# EAGLE schematic NN22_7Lvl_ResSrcAdapter02_s00 (EAGLE 7.7.0)

## Sheet 1 of 2
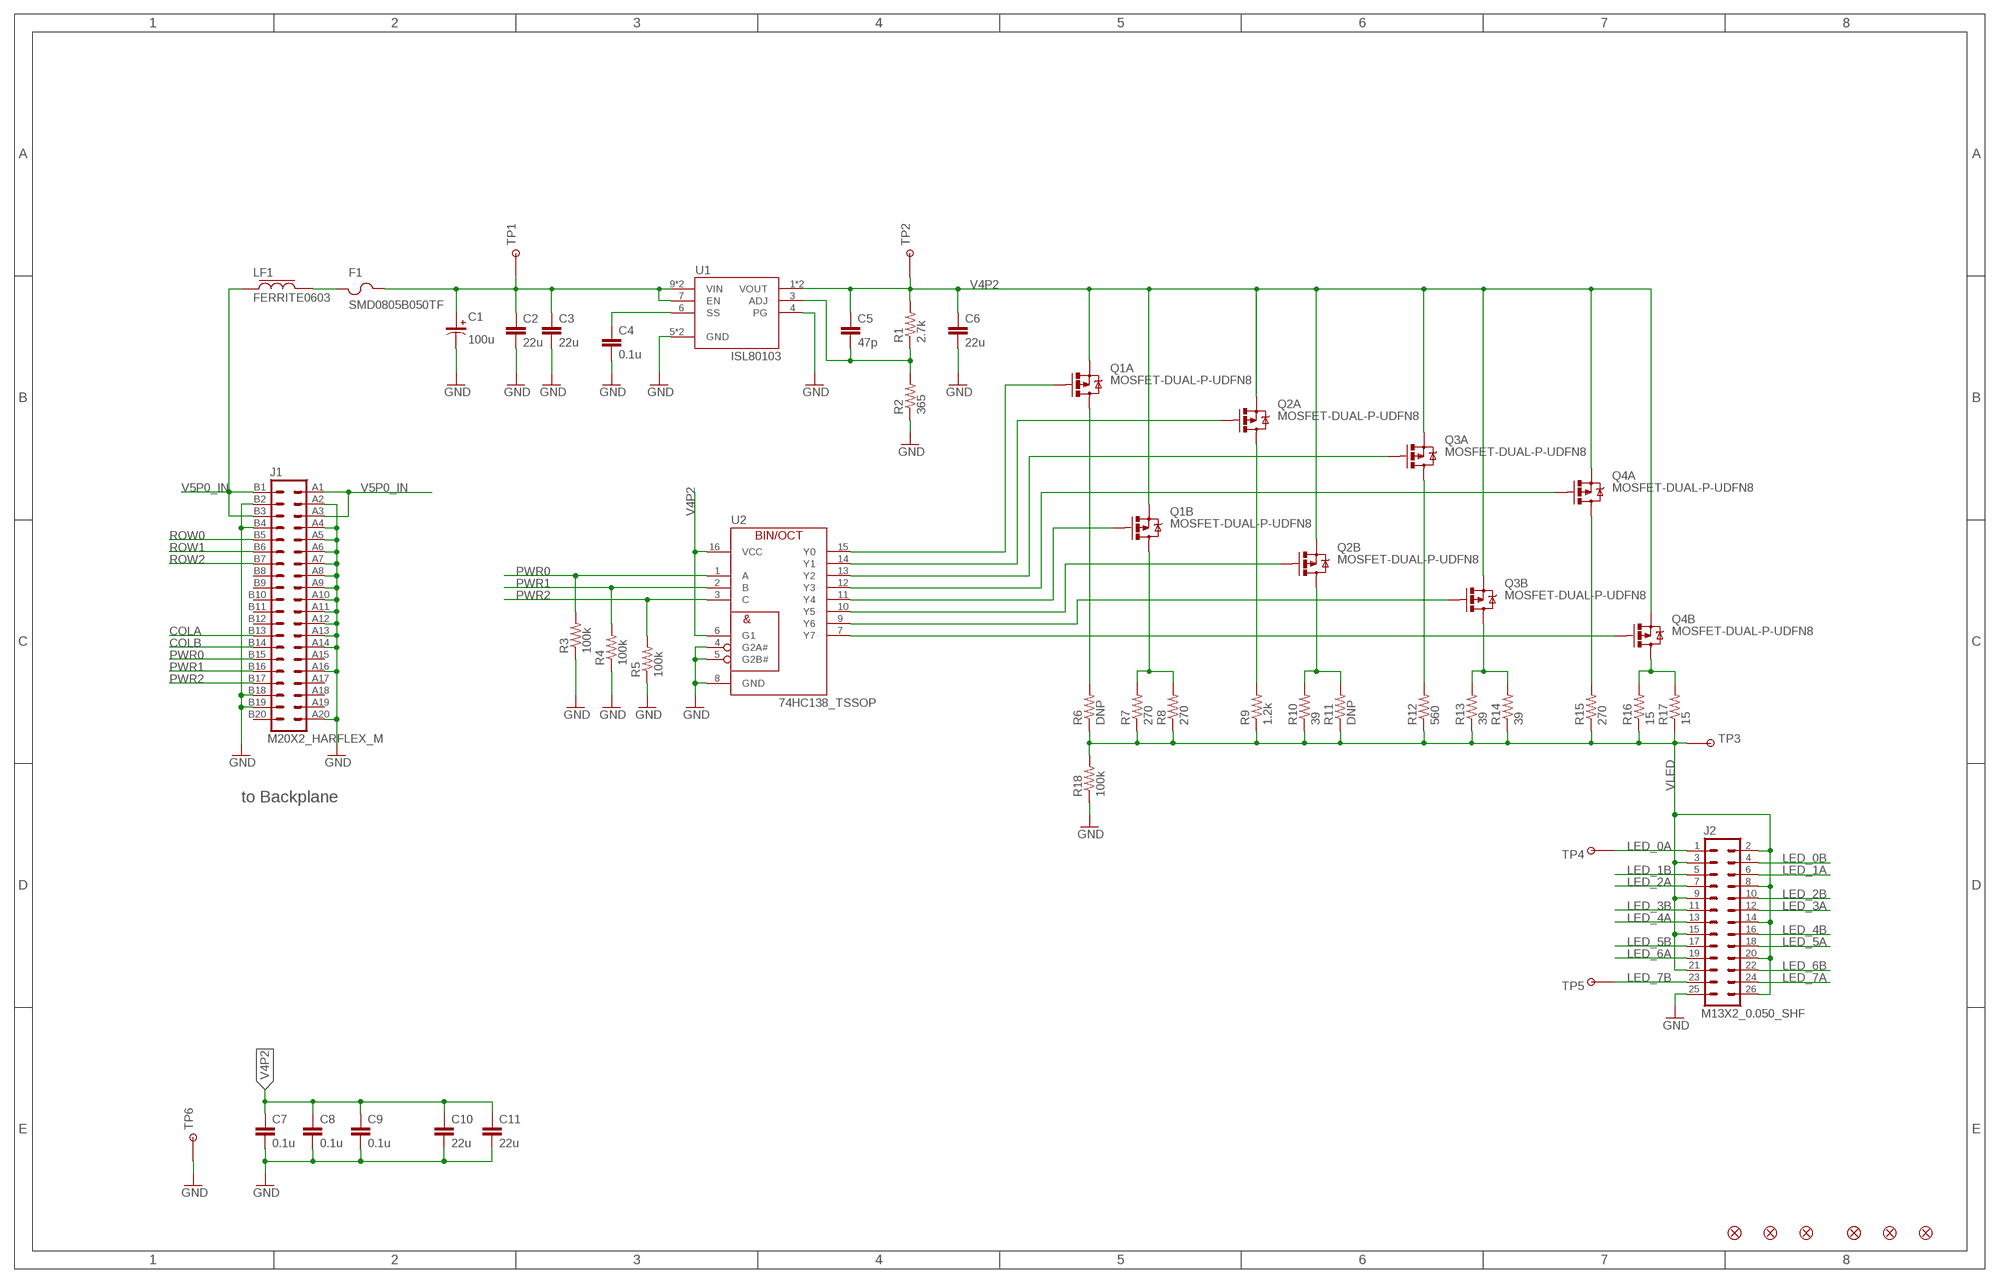
[diagram p0: schematic, sheet 1]

### Parts
C1  100u  CAP-POL2917  [2917-CAP]
C2  22u  CAP1206  [1206]
C3  22u  CAP1206  [1206]
C4  0.1u  CAP0402-CAP  [0402-CAP]
C5  47p  CAP0402-CAP  [0402-CAP]
C6  22u  CAP1206  [1206]
C7  0.1u  CAP0402-CAP  [0402-CAP]
C8  0.1u  CAP0402-CAP  [0402-CAP]
C9  0.1u  CAP0402-CAP  [0402-CAP]
C10  22u  CAP1206  [1206]
C11  22u  CAP1206  [1206]
F1  SMD0805B050TF  FUSE_0805  [0805]
FID1  FIDUCIALUFIDUCIAL  [MICRO-FIDUCIAL]
FID2  FIDUCIALUFIDUCIAL  [MICRO-FIDUCIAL]
FID3  FIDUCIALUFIDUCIAL  [MICRO-FIDUCIAL]
FID4  FIDUCIALUFIDUCIAL  [MICRO-FIDUCIAL]
FID5  FIDUCIALUFIDUCIAL  [MICRO-FIDUCIAL]
FID6  FIDUCIALUFIDUCIAL  [MICRO-FIDUCIAL]
J1  M20X2_HARFLEX_M  [M20X2_HARFLEX_M]
J2  M13X2_0.050_SHF  [M13X2_0.050_SHF]
LF1  FERRITE0603  [0603-FER]
Q1  MOSFET-DUAL-P-UDFN8  [UDFN8]
Q2  MOSFET-DUAL-P-UDFN8  [UDFN8]
Q3  MOSFET-DUAL-P-UDFN8  [UDFN8]
Q4  MOSFET-DUAL-P-UDFN8  [UDFN8]
R1  2.7k  RESISTOR0402-RES  [0402-RES]
R2  365  RESISTOR0402-RES  [0402-RES]
R3  100k  RESISTOR0402-RES  [0402-RES]
R4  100k  RESISTOR0402-RES  [0402-RES]
R5  100k  RESISTOR0402-RES  [0402-RES]
R6  DNP  RESISTOR0805-RES  [0805]
R7  270  RESISTOR0805-RES  [0805]
R8  270  RESISTOR0805-RES  [0805]
R9  1.2k  RESISTOR0805-RES  [0805]
R10  39  RESISTOR0805-RES  [0805]
R11  DNP  RESISTOR0805-RES  [0805]
R12  560  RESISTOR0805-RES  [0805]
R13  39  RESISTOR0805-RES  [0805]
R14  39  RESISTOR0805-RES  [0805]
R15  270  RESISTOR0805-RES  [0805]
R16  15  RESISTOR0805-RES  [0805]
R17  15  RESISTOR0805-RES  [0805]
R18  100k  RESISTOR0402-RES  [0402-RES]
TP1  TESTPOINT_ROUND  [TESTPAD_ROUND]
TP2  TESTPOINT_ROUND  [TESTPAD_ROUND]
TP3  TESTPOINT_ROUND  [TESTPAD_ROUND]
TP4  TESTPOINT_ROUND  [TESTPAD_ROUND]
TP5  TESTPOINT_ROUND  [TESTPAD_ROUND]
TP6  TESTPOINT1X01  [1X01]
U1  ISL80103  [DFN10_ISL]
U2  74HC138_TSSOP  [TSSOP16]

### Nets
COLA: J1.B13 ; also sheet 2
COLB: J1.B14 ; also sheet 2
GND: C1.N C2.2 C3.2 C4.2 C6.2 C7.2 C8.2 C9.2 C10.2 C11.2 J1.A2 J1.A4 J1.A5 J1.A6 J1.A7 J1.A8 J1.A9 J1.A10 J1.A11 J1.A12 J1.A13 J1.A14 J1.A16 J1.A20 J1.B2 J1.B4 J1.B18 J1.B19 J2.25 R2.1 R3.1 R4.1 R5.1 R18.1 TP6.1 U1.4(PG) U1.5(GND) U1.PAD(GND) U2.4(G2A#) U2.5(G2B#) U2.8(GND) ; also sheet 2
LED_0A: J2.1 TP4.P$1 ; also sheet 2
LED_0B: J2.4 ; also sheet 2
LED_1A: J2.6 ; also sheet 2
LED_1B: J2.5 ; also sheet 2
LED_2A: J2.7 ; also sheet 2
LED_2B: J2.10 ; also sheet 2
LED_3A: J2.12 ; also sheet 2
LED_3B: J2.11 ; also sheet 2
LED_4A: J2.13 ; also sheet 2
LED_4B: J2.16 ; also sheet 2
LED_5A: J2.18 ; also sheet 2
LED_5B: J2.17 ; also sheet 2
LED_6A: J2.19 ; also sheet 2
LED_6B: J2.22 ; also sheet 2
LED_7A: J2.24 ; also sheet 2
LED_7B: J2.23 TP5.P$1 ; also sheet 2
N$3: C4.1 U1.6(SS)
N$6: Q1.2(A:G) U2.15(Y0)
N$7: Q2.2(A:G) U2.14(Y1)
N$11: Q3.2(A:G) U2.13(Y2)
N$12: Q4.2(A:G) U2.12(Y3)
N$17: Q1.5(B:G) U2.11(Y4)
N$18: Q2.5(B:G) U2.10(Y5)
N$21: Q3.5(B:G) U2.9(Y6)
N$22: Q4.5(B:G) U2.7(Y7)
N$23: Q1.6(A:D) Q1.P1(A:D) R6.2
N$24: Q1.3(B:D) Q1.P2(B:D) R7.2 R8.2
N$25: Q2.3(B:D) Q2.P2(B:D) R10.2 R11.2
N$27: Q2.6(A:D) Q2.P1(A:D) R9.2
N$28: Q3.6(A:D) Q3.P1(A:D) R12.2
N$31: Q3.3(B:D) Q3.P2(B:D) R13.2 R14.2
N$32: Q4.6(A:D) Q4.P1(A:D) R15.2
N$35: Q4.3(B:D) Q4.P2(B:D) R16.2 R17.2
N$65: F1.1 LF1.2
N$66: C1.P C2.1 C3.1 F1.2 TP1.P$1 U1.7(EN) U1.9(VIN) U1.10(VIN)
N$68: C5.2 R1.1 R2.2 U1.3(ADJ)
PWR0: J1.B15 R3.2 U2.1(A)
PWR1: J1.B16 R4.2 U2.2(B)
PWR2: J1.B17 R5.2 U2.3(C)
ROW0: J1.B5 ; also sheet 2
ROW1: J1.B6 ; also sheet 2
ROW2: J1.B7 ; also sheet 2
V4P2: C5.1 C6.1 C7.1 C8.1 C9.1 C10.1 C11.1 Q1.1(A:S) Q1.4(B:S) Q2.1(A:S) Q2.4(B:S) Q3.1(A:S) Q3.4(B:S) Q4.1(A:S) Q4.4(B:S) R1.2 TP2.P$1 U1.1(VOUT) U1.2(VOUT) U2.6(G1) U2.16(VCC) ; also sheet 2
V5P0_IN: J1.A1 J1.A3 J1.B1 J1.B3 LF1.1
VLED: J2.2 J2.3 J2.8 J2.9 J2.14 J2.15 J2.20 J2.21 J2.26 R6.1 R7.1 R8.1 R9.1 R10.1 R11.1 R12.1 R13.1 R14.1 R15.1 R16.1 R17.1 R18.2 TP3.P$1 ; also sheet 2
Unconnected: J1.A15 J1.A17 J1.A18 J1.A19 J1.B8 J1.B9 J1.B10 J1.B11 J1.B12 J1.B20

### Notes on the sheet
- to Backplane

## Sheet 2 of 2
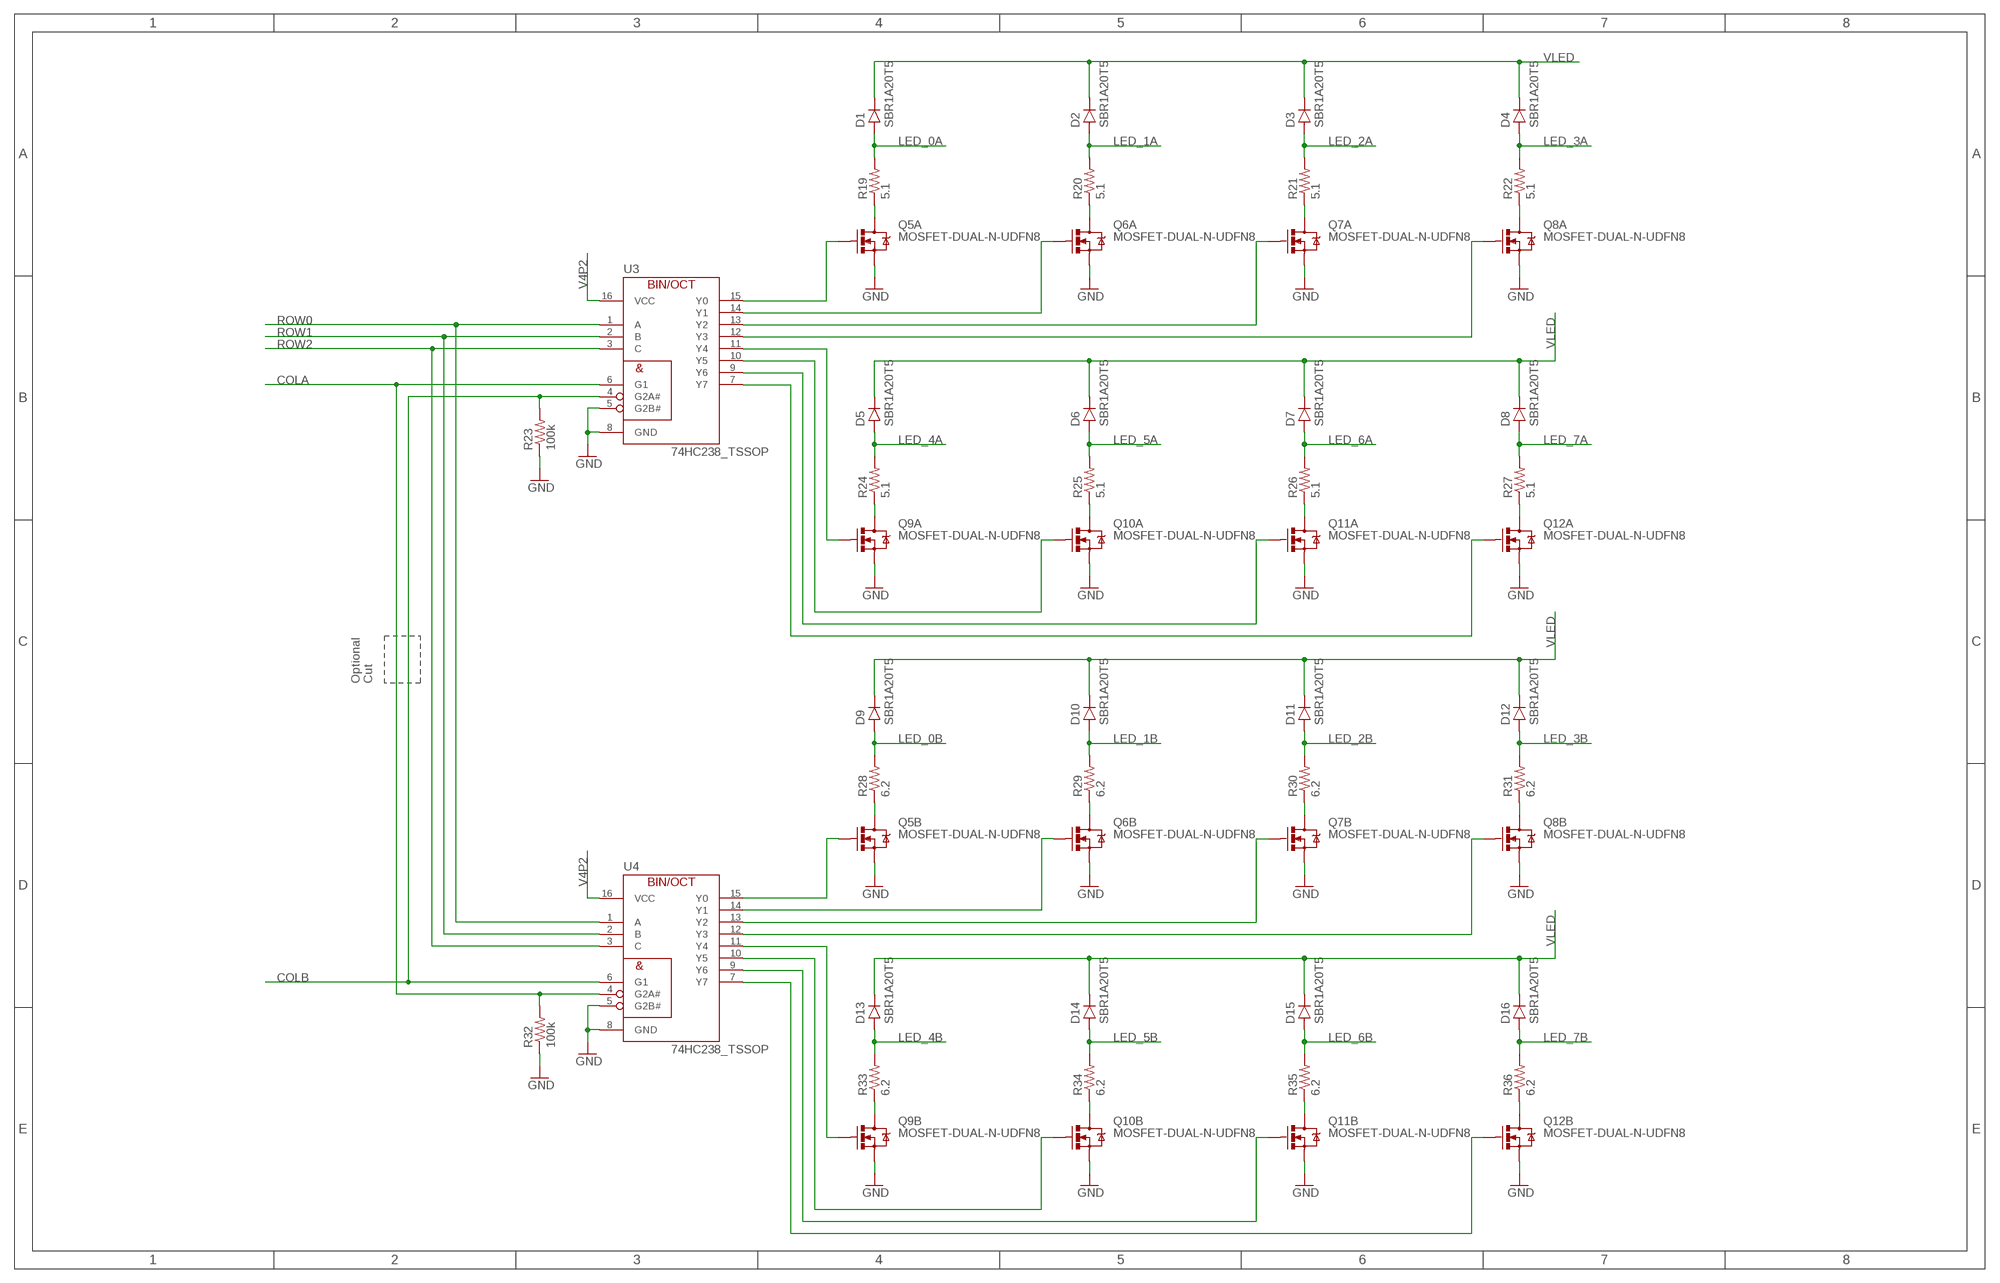
[diagram p1: schematic, sheet 2]

### Parts
D1  SBR1A20T5  DIODE_SOD523  [SOD523]
D2  SBR1A20T5  DIODE_SOD523  [SOD523]
D3  SBR1A20T5  DIODE_SOD523  [SOD523]
D4  SBR1A20T5  DIODE_SOD523  [SOD523]
D5  SBR1A20T5  DIODE_SOD523  [SOD523]
D6  SBR1A20T5  DIODE_SOD523  [SOD523]
D7  SBR1A20T5  DIODE_SOD523  [SOD523]
D8  SBR1A20T5  DIODE_SOD523  [SOD523]
D9  SBR1A20T5  DIODE_SOD523  [SOD523]
D10  SBR1A20T5  DIODE_SOD523  [SOD523]
D11  SBR1A20T5  DIODE_SOD523  [SOD523]
D12  SBR1A20T5  DIODE_SOD523  [SOD523]
D13  SBR1A20T5  DIODE_SOD523  [SOD523]
D14  SBR1A20T5  DIODE_SOD523  [SOD523]
D15  SBR1A20T5  DIODE_SOD523  [SOD523]
D16  SBR1A20T5  DIODE_SOD523  [SOD523]
Q5  MOSFET-DUAL-N-UDFN8  [UDFN8]
Q6  MOSFET-DUAL-N-UDFN8  [UDFN8]
Q7  MOSFET-DUAL-N-UDFN8  [UDFN8]
Q8  MOSFET-DUAL-N-UDFN8  [UDFN8]
Q9  MOSFET-DUAL-N-UDFN8  [UDFN8]
Q10  MOSFET-DUAL-N-UDFN8  [UDFN8]
Q11  MOSFET-DUAL-N-UDFN8  [UDFN8]
Q12  MOSFET-DUAL-N-UDFN8  [UDFN8]
R19  5.1  RESISTOR0805-RES  [0805]
R20  5.1  RESISTOR0805-RES  [0805]
R21  5.1  RESISTOR0805-RES  [0805]
R22  5.1  RESISTOR0805-RES  [0805]
R23  100k  RESISTOR0402-RES  [0402-RES]
R24  5.1  RESISTOR0805-RES  [0805]
R25  5.1  RESISTOR0805-RES  [0805]
R26  5.1  RESISTOR0805-RES  [0805]
R27  5.1  RESISTOR0805-RES  [0805]
R28  6.2  RESISTOR0805-RES  [0805]
R29  6.2  RESISTOR0805-RES  [0805]
R30  6.2  RESISTOR0805-RES  [0805]
R31  6.2  RESISTOR0805-RES  [0805]
R32  100k  RESISTOR0402-RES  [0402-RES]
R33  6.2  RESISTOR0805-RES  [0805]
R34  6.2  RESISTOR0805-RES  [0805]
R35  6.2  RESISTOR0805-RES  [0805]
R36  6.2  RESISTOR0805-RES  [0805]
U3  74HC238_TSSOP  [TSSOP16]
U4  74HC238_TSSOP  [TSSOP16]

### Nets
COLA: R32.2 U3.6(G1) U4.4(G2A#) ; also sheet 1
COLB: R23.2 U3.4(G2A#) U4.6(G1) ; also sheet 1
GND: Q5.1(A:S) Q5.4(B:S) Q6.1(A:S) Q6.4(B:S) Q7.1(A:S) Q7.4(B:S) Q8.1(A:S) Q8.4(B:S) Q9.1(A:S) Q9.4(B:S) Q10.1(A:S) Q10.4(B:S) Q11.1(A:S) Q11.4(B:S) Q12.1(A:S) Q12.4(B:S) R23.1 R32.1 U3.5(G2B#) U3.8(GND) U4.5(G2B#) U4.8(GND) ; also sheet 1
LED_0A: D1.A R19.2 ; also sheet 1
LED_0B: D9.A R28.2 ; also sheet 1
LED_1A: D2.A R20.2 ; also sheet 1
LED_1B: D10.A R29.2 ; also sheet 1
LED_2A: D3.A R21.2 ; also sheet 1
LED_2B: D11.A R30.2 ; also sheet 1
LED_3A: D4.A R22.2 ; also sheet 1
LED_3B: D12.A R31.2 ; also sheet 1
LED_4A: D5.A R24.2 ; also sheet 1
LED_4B: D13.A R33.2 ; also sheet 1
LED_5A: D6.A R25.2 ; also sheet 1
LED_5B: D14.A R34.2 ; also sheet 1
LED_6A: D7.A R26.2 ; also sheet 1
LED_6B: D15.A R35.2 ; also sheet 1
LED_7A: D8.A R27.2 ; also sheet 1
LED_7B: D16.A R36.2 ; also sheet 1
N$1: Q7.2(A:G) U3.13(Y2)
N$2: Q7.6(A:D) Q7.P1(A:D) R21.1
N$4: Q5.2(A:G) U3.15(Y0)
N$5: Q5.6(A:D) Q5.P1(A:D) R19.1
N$8: Q5.5(B:G) U4.15(Y0)
N$9: Q5.3(B:D) Q5.P2(B:D) R28.1
N$10: Q8.2(A:G) U3.12(Y3)
N$13: Q7.5(B:G) U4.13(Y2)
N$14: Q7.3(B:D) Q7.P2(B:D) R30.1
N$15: Q6.2(A:G) U3.14(Y1)
N$16: Q6.6(A:D) Q6.P1(A:D) R20.1
N$19: Q6.5(B:G) U4.14(Y1)
N$20: Q6.3(B:D) Q6.P2(B:D) R29.1
N$26: Q8.6(A:D) Q8.P1(A:D) R22.1
N$29: Q8.5(B:G) U4.12(Y3)
N$30: Q8.3(B:D) Q8.P2(B:D) R31.1
N$33: Q9.2(A:G) U3.11(Y4)
N$34: Q9.6(A:D) Q9.P1(A:D) R24.1
N$37: Q9.5(B:G) U4.11(Y4)
N$38: Q9.3(B:D) Q9.P2(B:D) R33.1
N$41: Q10.2(A:G) U3.10(Y5)
N$42: Q10.6(A:D) Q10.P1(A:D) R25.1
N$45: Q10.5(B:G) U4.10(Y5)
N$46: Q10.3(B:D) Q10.P2(B:D) R34.1
N$49: Q11.2(A:G) U3.9(Y6)
N$50: Q11.6(A:D) Q11.P1(A:D) R26.1
N$53: Q11.5(B:G) U4.9(Y6)
N$54: Q11.3(B:D) Q11.P2(B:D) R35.1
N$57: Q12.2(A:G) U3.7(Y7)
N$58: Q12.6(A:D) Q12.P1(A:D) R27.1
N$61: Q12.5(B:G) U4.7(Y7)
N$62: Q12.3(B:D) Q12.P2(B:D) R36.1
ROW0: U3.1(A) U4.1(A) ; also sheet 1
ROW1: U3.2(B) U4.2(B) ; also sheet 1
ROW2: U3.3(C) U4.3(C) ; also sheet 1
V4P2: U3.16(VCC) U4.16(VCC) ; also sheet 1
VLED: D1.C D2.C D3.C D4.C D5.C D6.C D7.C D8.C D9.C D10.C D11.C D12.C D13.C D14.C D15.C D16.C ; also sheet 1

### Notes on the sheet
- Optional 
  Cut

## Library data of the parts
C1 = MyLib:CAP-POL
C2-C11 = MyLib:CAP: Capacitor Standard 0603 ceramic capacitor, and 0.1" leaded capacitor.
D1-D16 = MyLib:DIODE
F1 = MyLib:FUSE
FID1-FID6 = MyLib:FIDUCIAL: Fiducial Alignment Points Various fiducial points for machine vision alignment.
J1 = MyLib:M20X2
J2 = MyLib:M13X2: Header 26 Positions SHF-113-01-L-D-SM SAM10712-ND
LF1 = MyLib:FERRITE: Ferrite e.g. 445-1561-1-ND
Q1-Q4 = MyLib:MOSFET-DUAL-P: e.g. SSM6P69NU
Q5-Q12 = MyLib:MOSFET-DUAL-N
R1-R36 = MyLib:RESISTOR: Resistor Basic schematic elements and footprints for 0603, 1206, and PTH resistors.
TP1-TP6 = MyLib:TESTPOINT
U1 = MyLib:ISL80103: Voltage Regulator, Linear, 3A, 6V in max pin compatible ISL80102
U2 = MyLib:74HC138: 3 to 8 line decoder, inverted outputs
U3 U4 = MyLib:74HC238: 3 to 8 line decoder